# Altium schematic sheet P02_BLOCK DIAGRAM_POWER TREE.SchDoc
size 840 x 594 mm
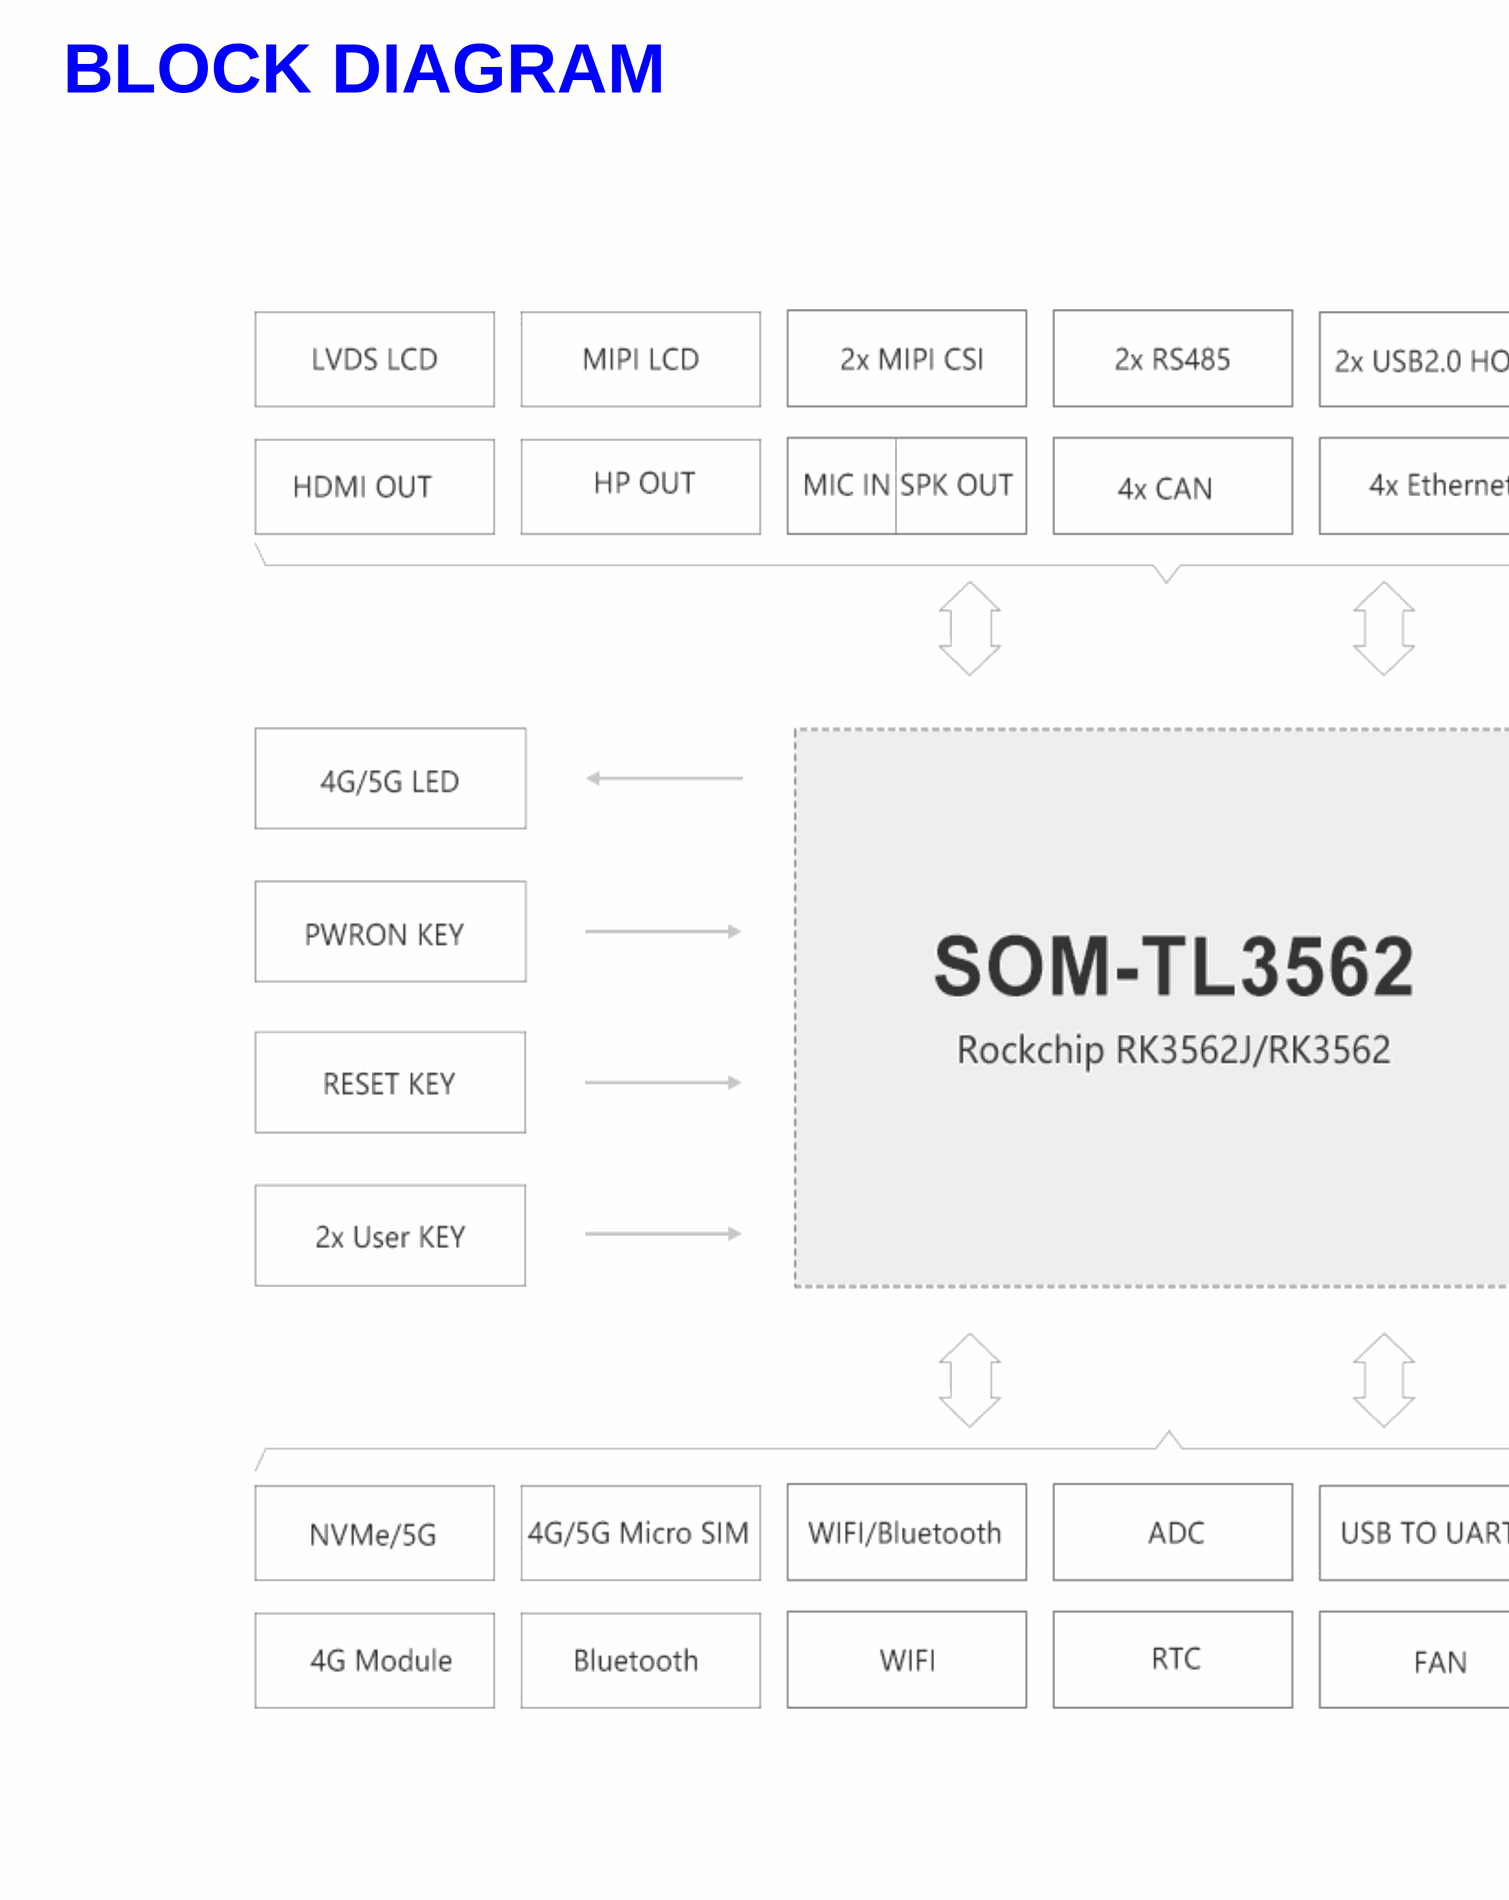
[diagram p0: P02_BLOCK DIAGRAM_POWER TREE.SchDoc, top left]
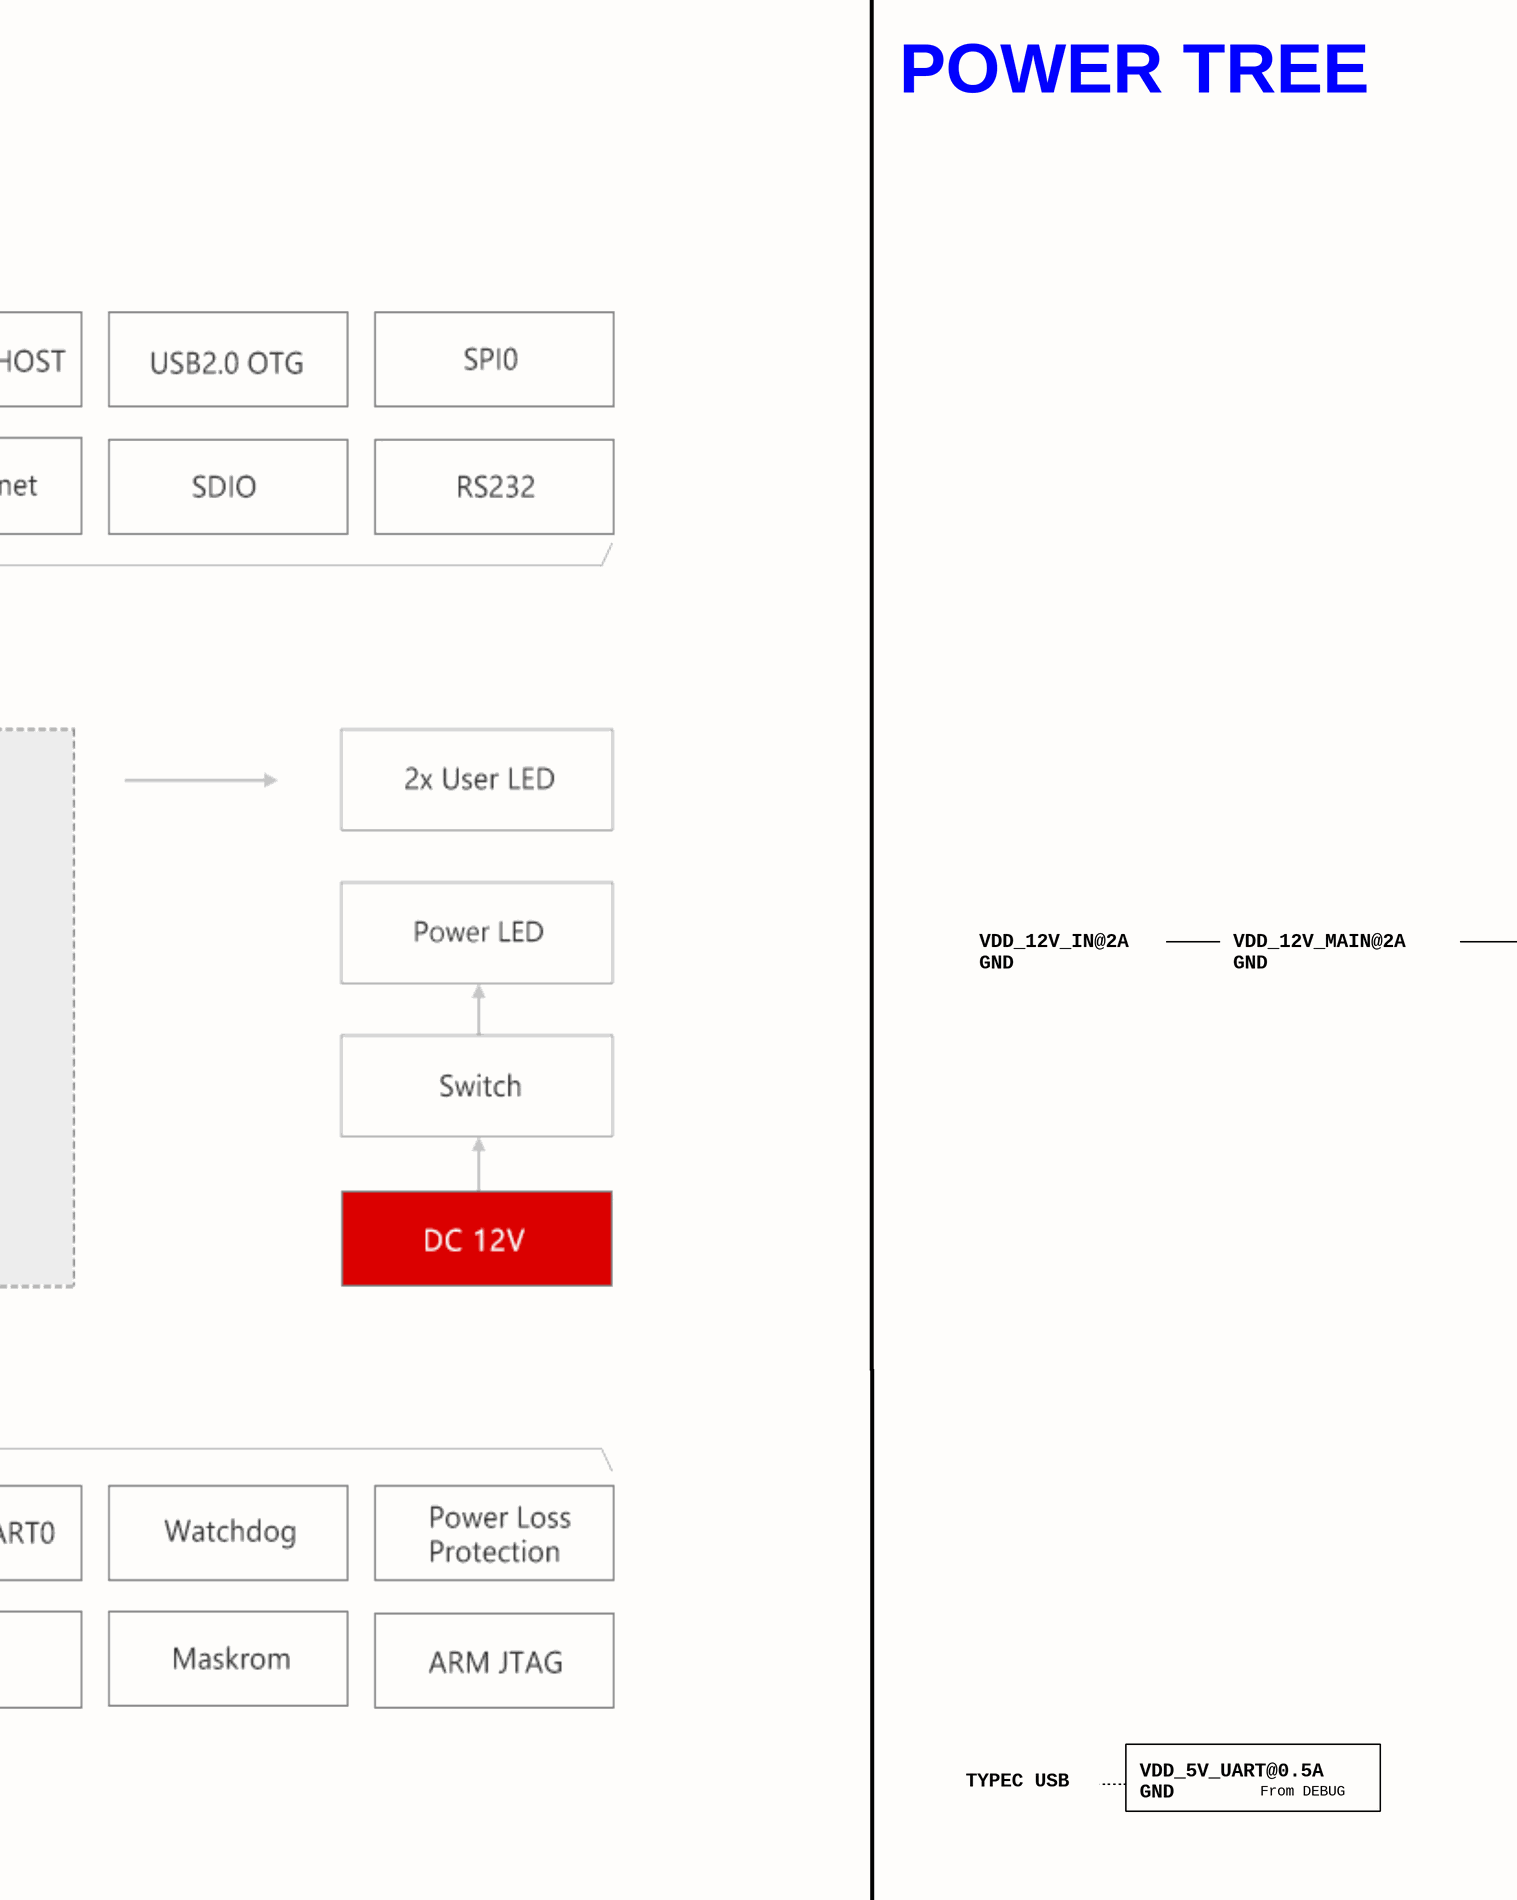
[diagram p1: P02_BLOCK DIAGRAM_POWER TREE.SchDoc, top middle]
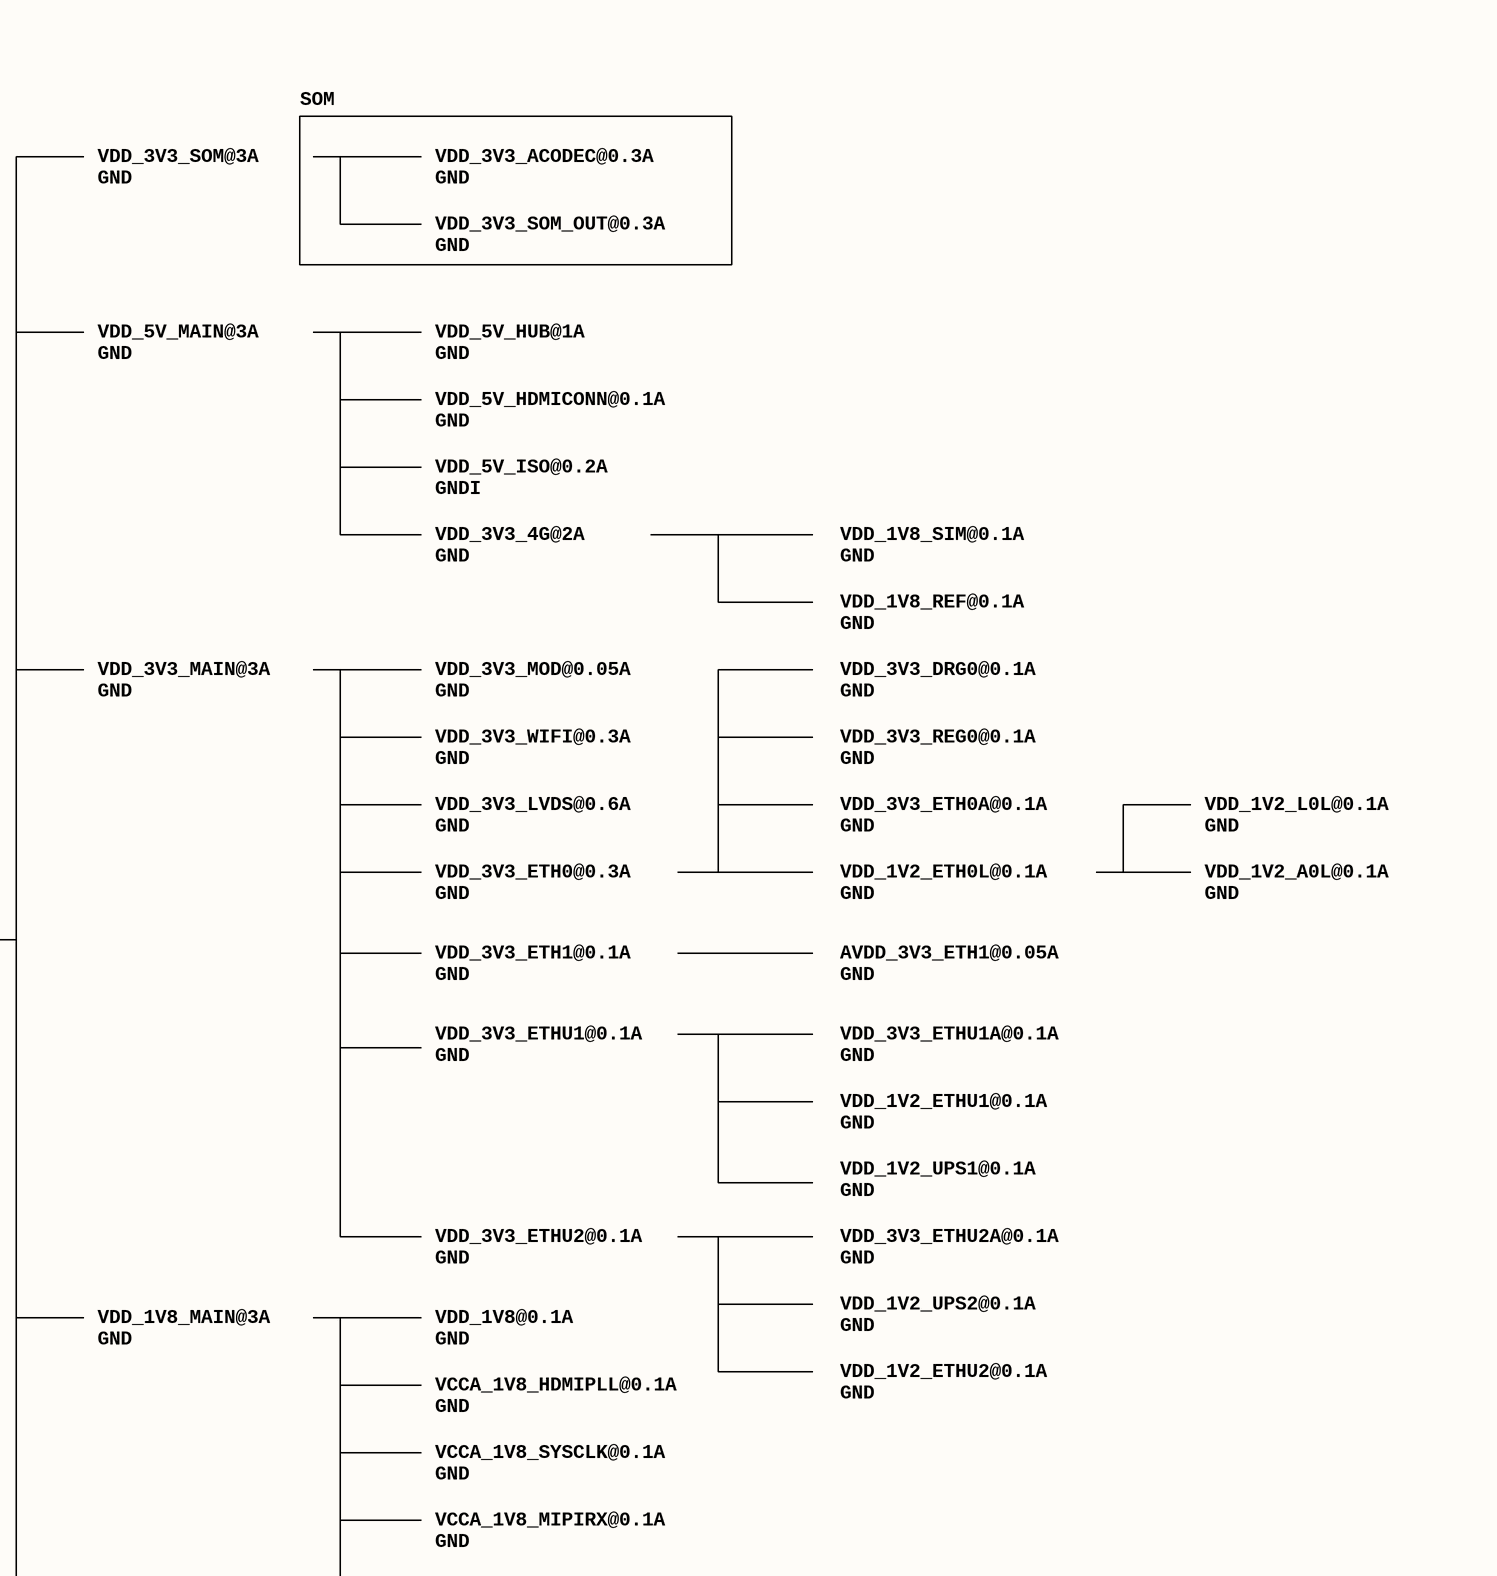
[diagram p2: P02_BLOCK DIAGRAM_POWER TREE.SchDoc, top right]
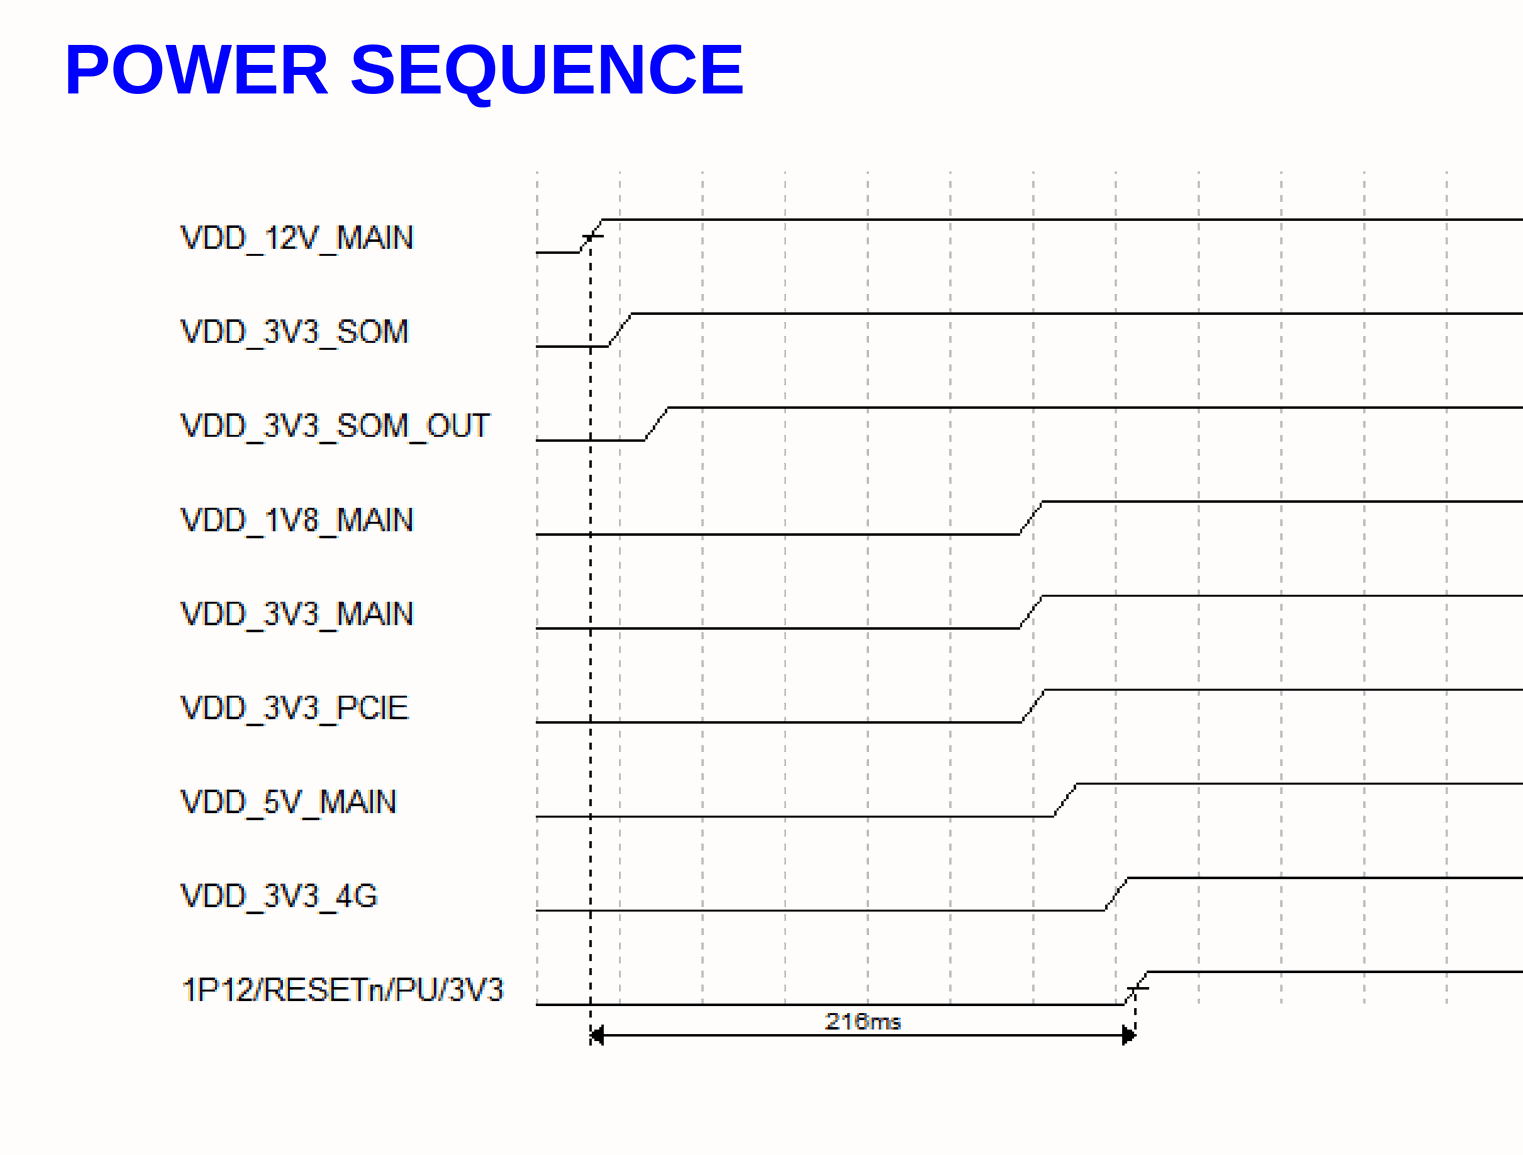
[diagram p3: P02_BLOCK DIAGRAM_POWER TREE.SchDoc, bottom left]
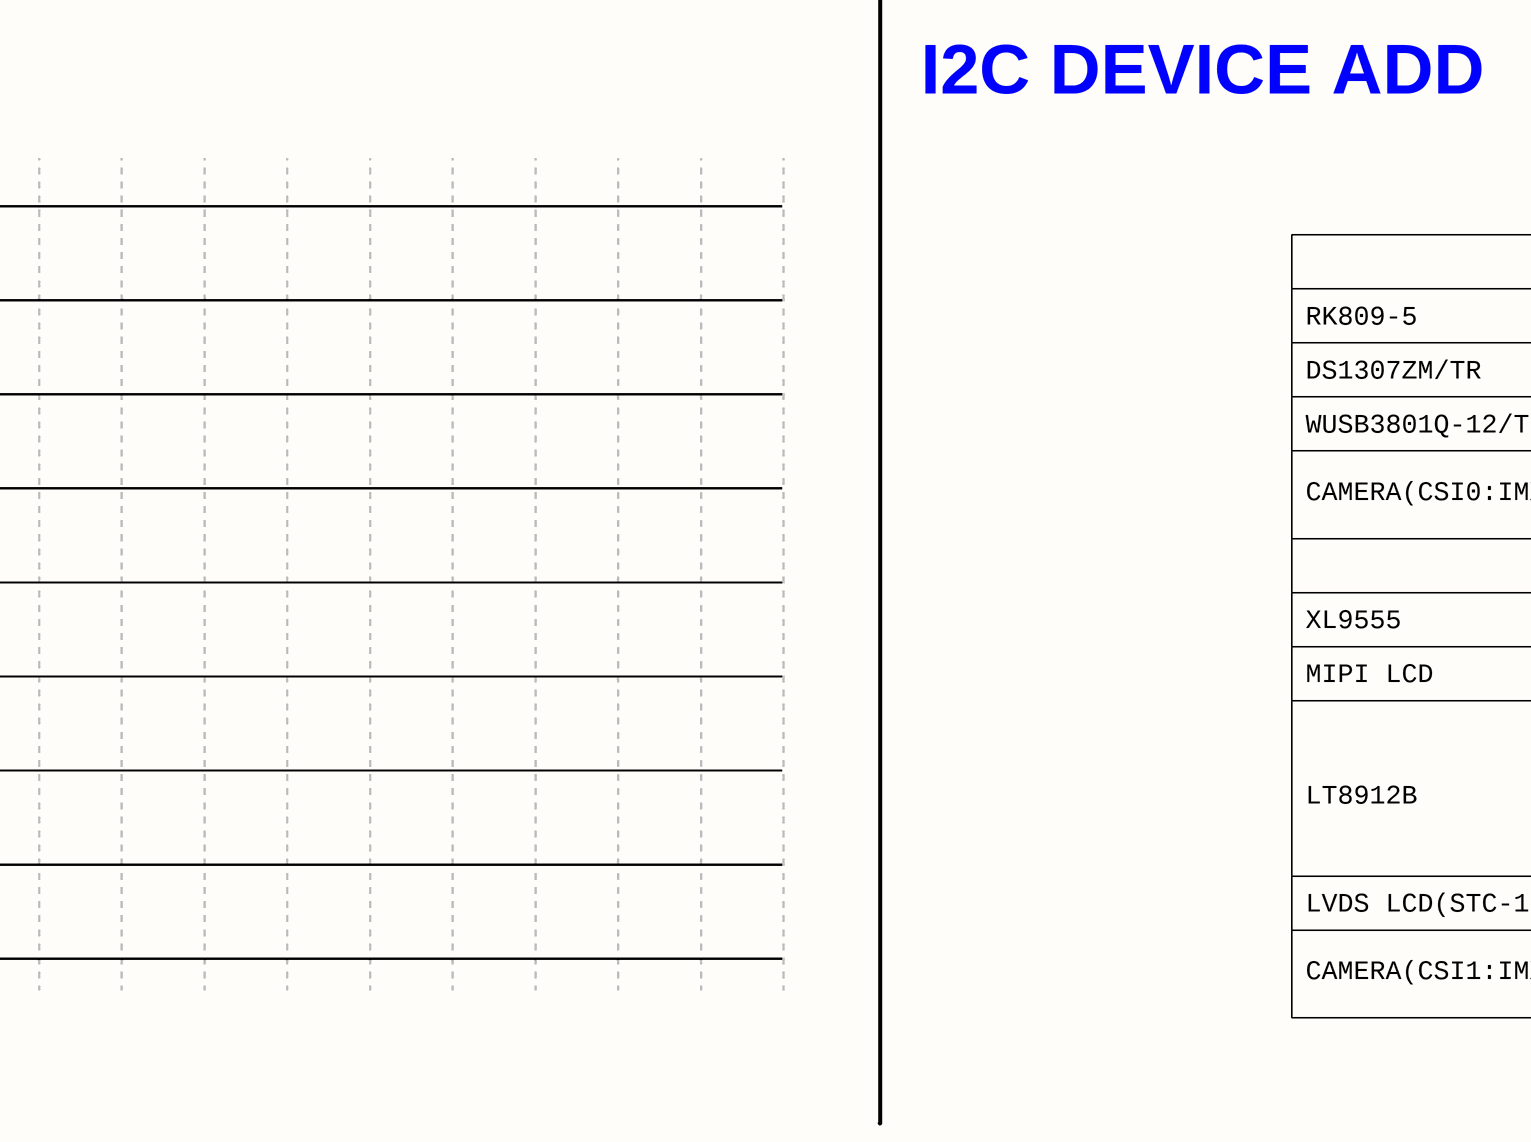
[diagram p4: P02_BLOCK DIAGRAM_POWER TREE.SchDoc, bottom middle]
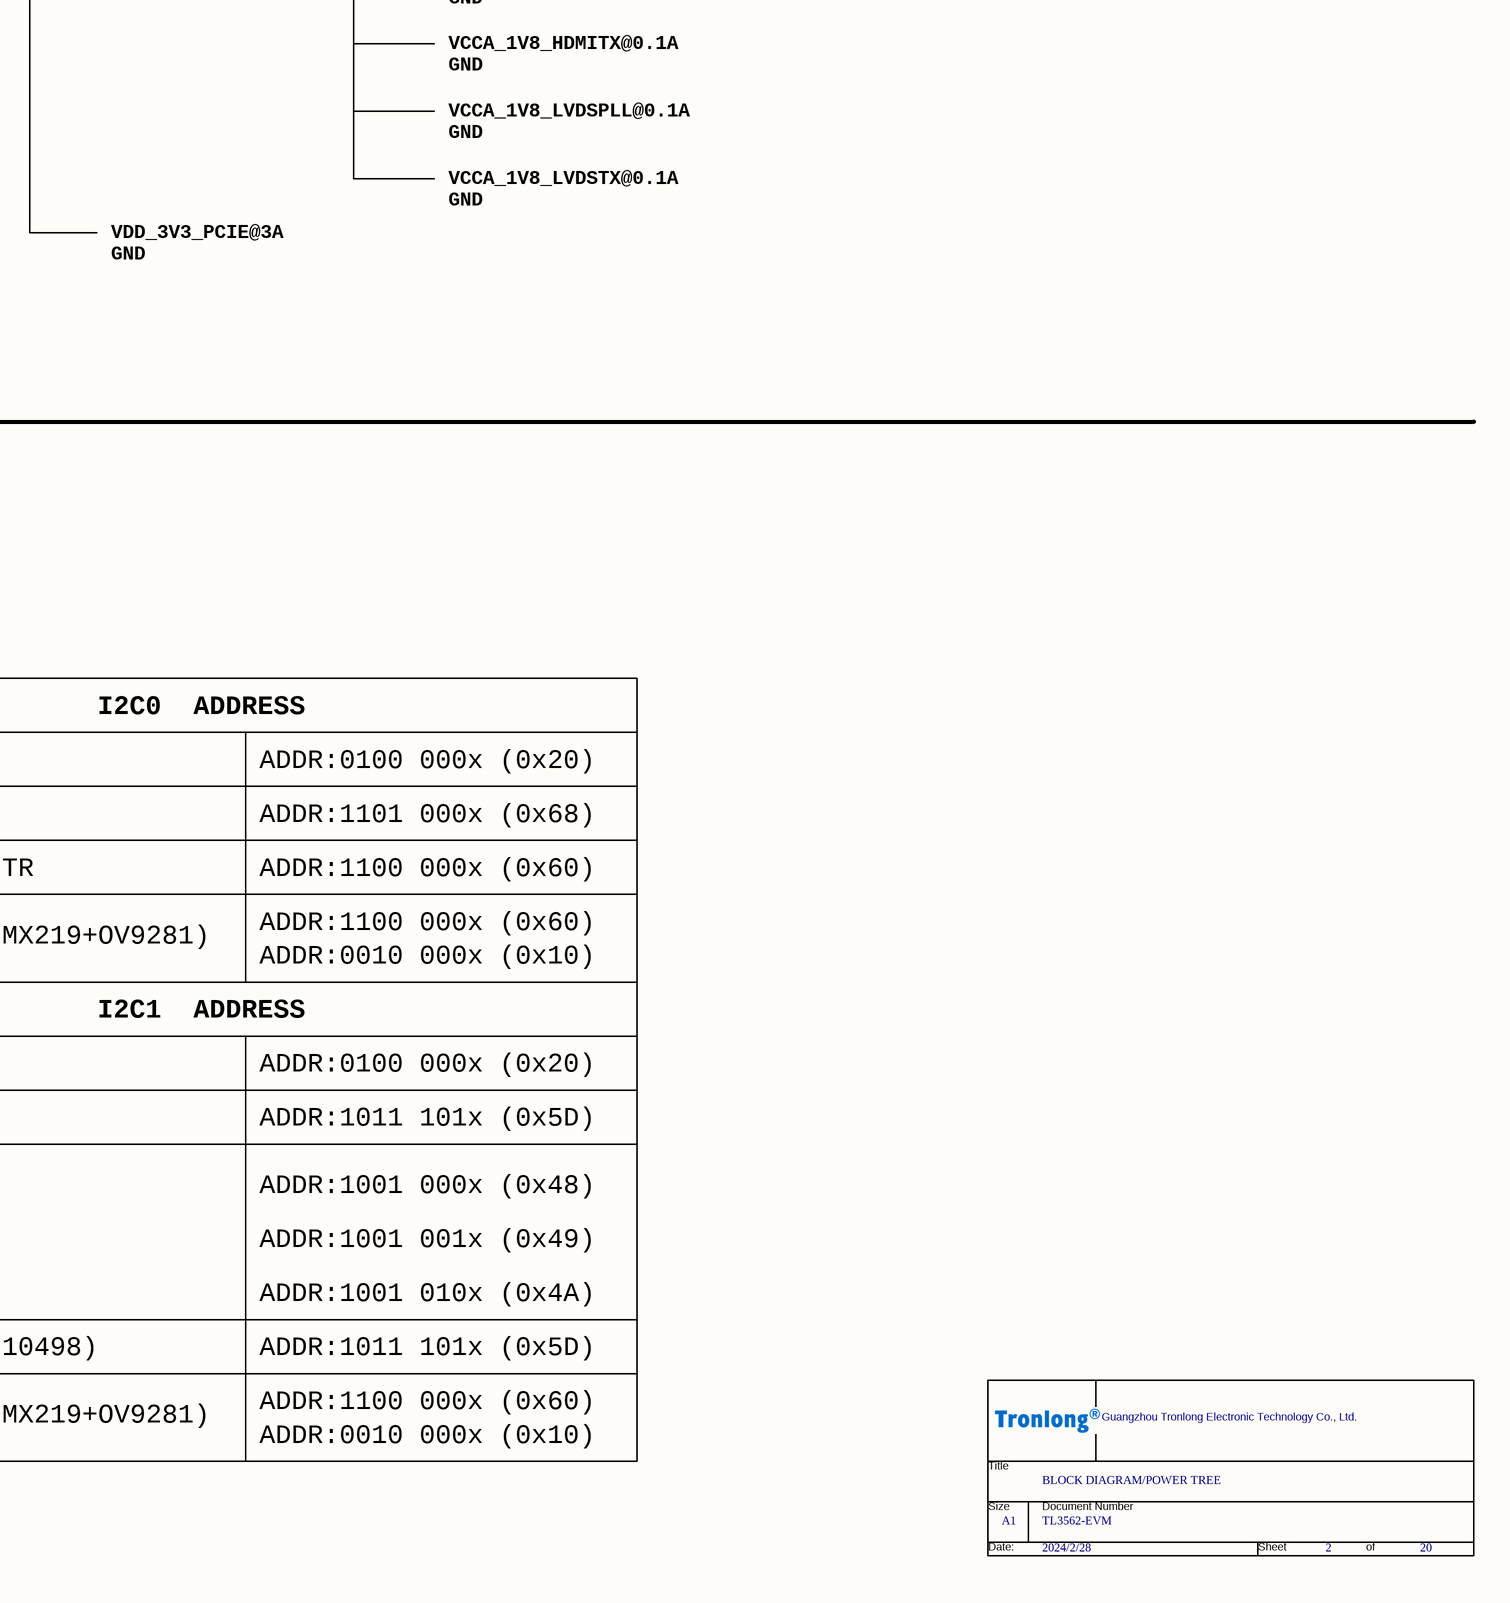
[diagram p5: P02_BLOCK DIAGRAM_POWER TREE.SchDoc, bottom right]

## Parts
*  Page Count: 20  Page Number: 2  Page Size: A1  OrgName: Guangzhou Tronlong Electronic Technology Co., Ltd.  Title: BLOCK DIAGRAM/POWER TREE  Doc: TL3562-EVM  Page Modify Date: 2024/2/28  (hidden comment: Tronlong_TITTLE_20211115)  (graphical)

## Notes on the sheet
- BLOCK DIAGRAM
- POWER TREE
- SOM
- VDD_3V3_SOM@3A
  GND
- VDD_3V3_ACODEC@0.3A
  GND
- VDD_3V3_SOM_OUT@0.3A
  GND
- VDD_5V_MAIN@3A
  GND
- VDD_5V_HUB@1A
  GND
- VDD_5V_HDMICONN@0.1A
  GND
- VDD_5V_ISO@0.2A
  GNDI
- VDD_3V3_4G@2A
  GND
- VDD_1V8_SIM@0.1A
  GND
- VDD_1V8_REF@0.1A
  GND
- VDD_3V3_MAIN@3A
  GND
- VDD_3V3_MOD@0.05A
  GND
- VDD_3V3_DRG0@0.1A
  GND
- VDD_3V3_WIFI@0.3A
  GND
- VDD_3V3_REG0@0.1A
  GND
- VDD_3V3_LVDS@0.6A
  GND
- VDD_3V3_ETH0A@0.1A
  GND
- VDD_1V2_L0L@0.1A
  GND
- VDD_3V3_ETH0@0.3A
  GND
- VDD_1V2_ETH0L@0.1A
  GND
- VDD_1V2_A0L@0.1A
  GND
- VDD_12V_IN@2A
  GND
- VDD_12V_MAIN@2A
  GND
- VDD_3V3_ETH1@0.1A
  GND
- AVDD_3V3_ETH1@0.05A
  GND
- VDD_3V3_ETHU1@0.1A
  GND
- VDD_3V3_ETHU1A@0.1A
  GND
- VDD_1V2_ETHU1@0.1A
  GND
- VDD_1V2_UPS1@0.1A
  GND
- VDD_3V3_ETHU2@0.1A
  GND
- VDD_3V3_ETHU2A@0.1A
  GND
- VDD_1V8_MAIN@3A
  GND
- VDD_1V8@0.1A
  GND
- VDD_1V2_UPS2@0.1A
  GND
- VCCA_1V8_HDMIPLL@0.1A
  GND
- VDD_1V2_ETHU2@0.1A
  GND
- VCCA_1V8_SYSCLK@0.1A
  GND
- VCCA_1V8_MIPIRX@0.1A
  GND
- VCCA_1V8_HDMITX@0.1A
  GND
- VCCA_1V8_LVDSPLL@0.1A
  GND
- VCCA_1V8_LVDSTX@0.1A
  GND
- TYPEC USB
- VDD_5V_UART@0.5A
  GND
- From DEBUG
- VDD_3V3_PCIE@3A
  GND
- POWER SEQUENCE
- I2C DEVICE ADD
- I2C0  ADDRESS
- RK809-5
- ADDR:0100 000x (0x20)
- DS1307ZM/TR
- ADDR:1101 000x (0x68)
- WUSB3801Q-12/TR
- ADDR:1100 000x (0x60)
- CAMERA(CSI0:IMX219+OV9281)
- ADDR:0010 000x (0x10)
- I2C1  ADDRESS
- XL9555
- MIPI LCD
- ADDR:1011 101x (0x5D)
- LT8912B
- ADDR:1001 000x (0x48)
- ADDR:1001 001x (0x49)
- ADDR:1001 010x (0x4A)
- LVDS LCD(STC-10498)
- CAMERA(CSI1:IMX219+OV9281)
- (in symbol Tronlong_TITTLE_20211115) Title; Size; Document Number; Date:; Sheet; of

## Library data of the parts
* = Tronlong_TITTLE_20211115: RevCode: A?; Page Create Date: March  8, 1995